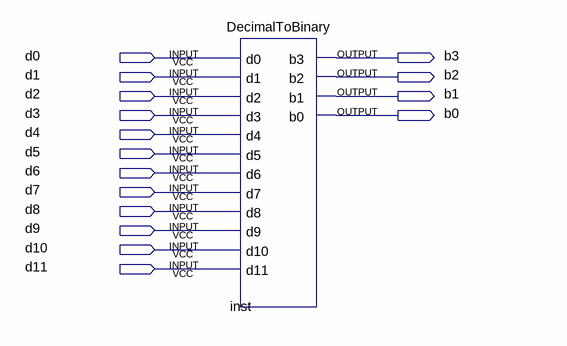
[diagram p0: schematic sheet]
// Quartus schematic DecimalToBinarySymbol.bdf as structural Verilog: 1 symbols, 16 pins
module DecimalToBinarySymbol (
  input  d0,
  input  d1,
  input  d2,
  input  d3,
  input  d4,
  input  d5,
  input  d6,
  input  d7,
  input  d8,
  input  d9,
  input  d10,
  input  d11,
  output b3,
  output b2,
  output b1,
  output b0
);

  DecimalToBinary inst (
    .d0(d0), .d1(d1), .d2(d2), .d3(d3), .d4(d4), .d5(d5), .d6(d6), .d7(d7), .d8(d8), .d9(d9), .d10(d10),
    .d11(d11), .b3(b3), .b2(b2), .b1(b1), .b0(b0));
endmodule
